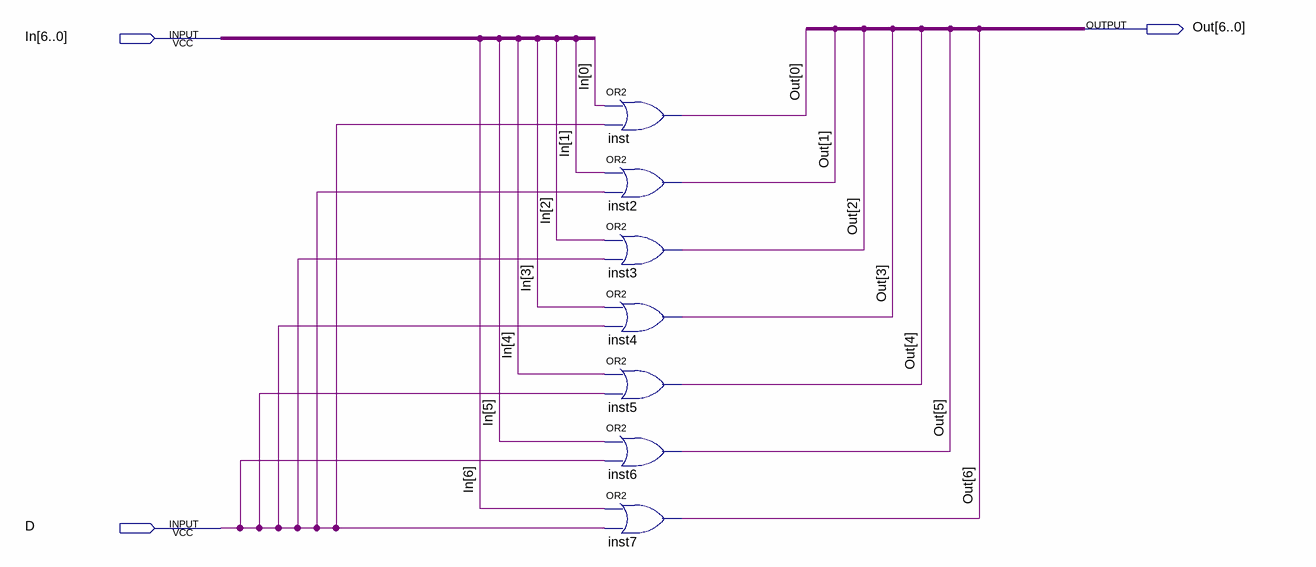
[diagram p0: schematic sheet]
// Quartus schematic display_handler.bdf as structural Verilog: 7 symbols, 3 pins
module display_handler (
  input  [6:0] In,
  input  D,
  output [6:0] Out
);

  or inst (Out[0], In[0], D);
  or inst2 (Out[1], In[1], D);
  or inst3 (Out[2], In[2], D);
  or inst4 (Out[3], In[3], D);
  or inst5 (Out[4], In[4], D);
  or inst6 (Out[5], In[5], D);
  or inst7 (Out[6], In[6], D);
endmodule
